# EAGLE schematic Pet_BOT_schematic_30pin (EAGLE 9.7.0)
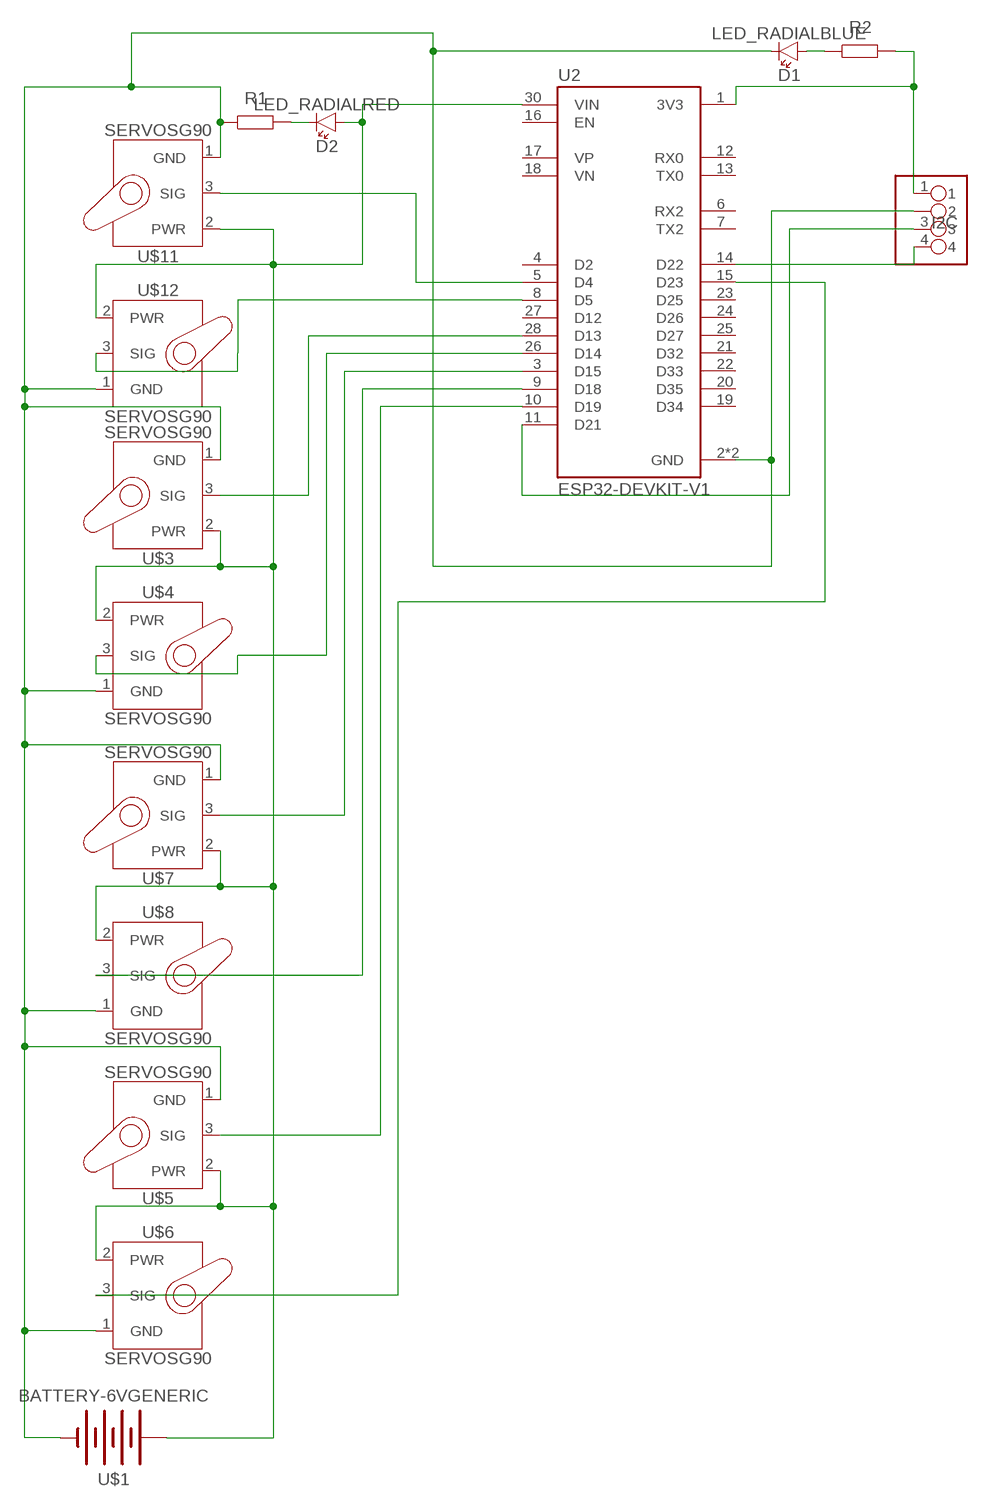
[diagram p0: schematic, sheet 1]

## Parts
D1  LED_RADIALBLUE  [LEDRD254W60D565H860B_B]
D2  LED_RADIALRED  [LEDRD254W60D565H860B_R]
R1  R_AXIAL-11.7MM-PITCH  [RESAD1176W63L850D250B]
R2  R_AXIAL-11.7MM-PITCH  [RESAD1176W63L850D250B]
U2  ESP32-DEVKIT-V1  [MODULE_ESP32_DEVKIT_V1]
U$1  BATTERY-6VGENERIC  [BATTERY-GENERIC]
U$2  PINHD-1X04_1X04M  [1X04]
U$3  SERVOSG90  [SG90]
U$4  SERVOSG90  [SG90]
U$5  SERVOSG90  [SG90]
U$6  SERVOSG90  [SG90]
U$7  SERVOSG90  [SG90]
U$8  SERVOSG90  [SG90]
U$11  SERVOSG90  [SG90]
U$12  SERVOSG90  [SG90]

## Nets
N$1: U2.14(D22) U$2.4
N$2: D2.C R1.2
N$3: U2.11(D21) U$2.3
N$4: D1.A R2.1
N$5: R2.2 U2.1(3V3) U$2.1
N$7: D2.A U2.30(VIN) U$1.+ U$3.2(PWR) U$4.2(PWR) U$5.2(PWR) U$6.2(PWR) U$7.2(PWR) U$8.2(PWR) U$11.2(PWR) U$12.2(PWR)
N$8: D1.C R1.1 U2.2(GND) U2.29(GND) U$1.- U$2.2 U$3.1(GND) U$4.1(GND) U$5.1(GND) U$6.1(GND) U$7.1(GND) U$8.1(GND) U$11.1(GND) U$12.1(GND)
N$17: U2.5(D4) U$11.3(SIG)
N$18: U2.8(D5) U$12.3(SIG)
N$19: U2.28(D13) U$3.3(SIG)
N$20: U2.26(D14) U$4.3(SIG)
N$21: U2.3(D15) U$7.3(SIG)
N$23: U2.10(D19) U$5.3(SIG)
N$24: U2.15(D23) U$6.3(SIG)
N$32: U2.9(D18) U$8.3(SIG)
Unconnected: U2.4(D2) U2.6(RX2) U2.7(TX2) U2.12(RX0) U2.13(TX0) U2.16(EN) U2.17(VP) U2.18(VN) U2.19(D34) U2.20(D35) U2.21(D32) U2.22(D33) U2.23(D25) U2.24(D26) U2.25(D27) U2.27(D12)

## Library data of the parts
D1 = Opto-Electronic:LED_RADIAL: LED - Generic; CATEGORY: Optoelectronics; COLOR: Blue; DESCRIPTION: Radial LED (Round) 2.54 mm pitch 5.65 mm body diameter 8.60 mm body height Blue; PACKAGE_SIZE: 5mm; PACKAGE_TYPE: Through Hole; SUBCATEGORY: LED; TYPE: Round
D2 = Opto-Electronic:LED_RADIAL: LED - Generic; CATEGORY: Optoelectronics; COLOR: Red; DESCRIPTION: Radial LED (Round) 2.54 mm pitch 5.65 mm body diameter 8.60 mm body height Red; PACKAGE_SIZE: 5mm; PACKAGE_TYPE: Through Hole; SUBCATEGORY: LED; TYPE: Round
R1 R2 = Resistor:R: Resistor Fixed - Generic; CATEGORY: Resistors; DESCRIPTION: Axial Resistor 11.76 mm pitch 8.5 mm body length 2.5 mm body diameter; PACKAGE_SIZE: Axial; PACKAGE_TYPE: Through Hole
U2 = ESP32-DEVKIT-V1:ESP32-DEVKIT-V1: Check availability <https://pricing.snapeda.com/parts/ESP32-DEVKIT-V1/Do%20it/view-part?ref=eda>; AVAILABILITY: Not in stock; CHECK_PRICES: https://www.snapeda.com/parts/ESP32-DEVKIT-V1/Do+it/view-part/?ref=eda; DESCRIPTION: Dual core, Wi-Fi: 2.4 GHz up to 150 Mbits/s,BLE (Bluetooth Low Energy) and legacy Bluetooth, 32 bits, Up to 240 MHz; MF: Do it; MP: ESP32-DEVKIT-V1; PACKAGE: None; PRICE: None; SNAPEDA_LINK: https://www.snapeda.com/parts/ESP32-DEVKIT-V1/Do+it/view-part/?ref=snap
U$1 = Tinkercad:BATTERY-6V
U$2 = Tinkercad:PINHD-1X04
U$3-U$8 U$11 U$12 = Tinkercad:SERVO